# EAGLE schematic lun1k (EAGLE 6.2)
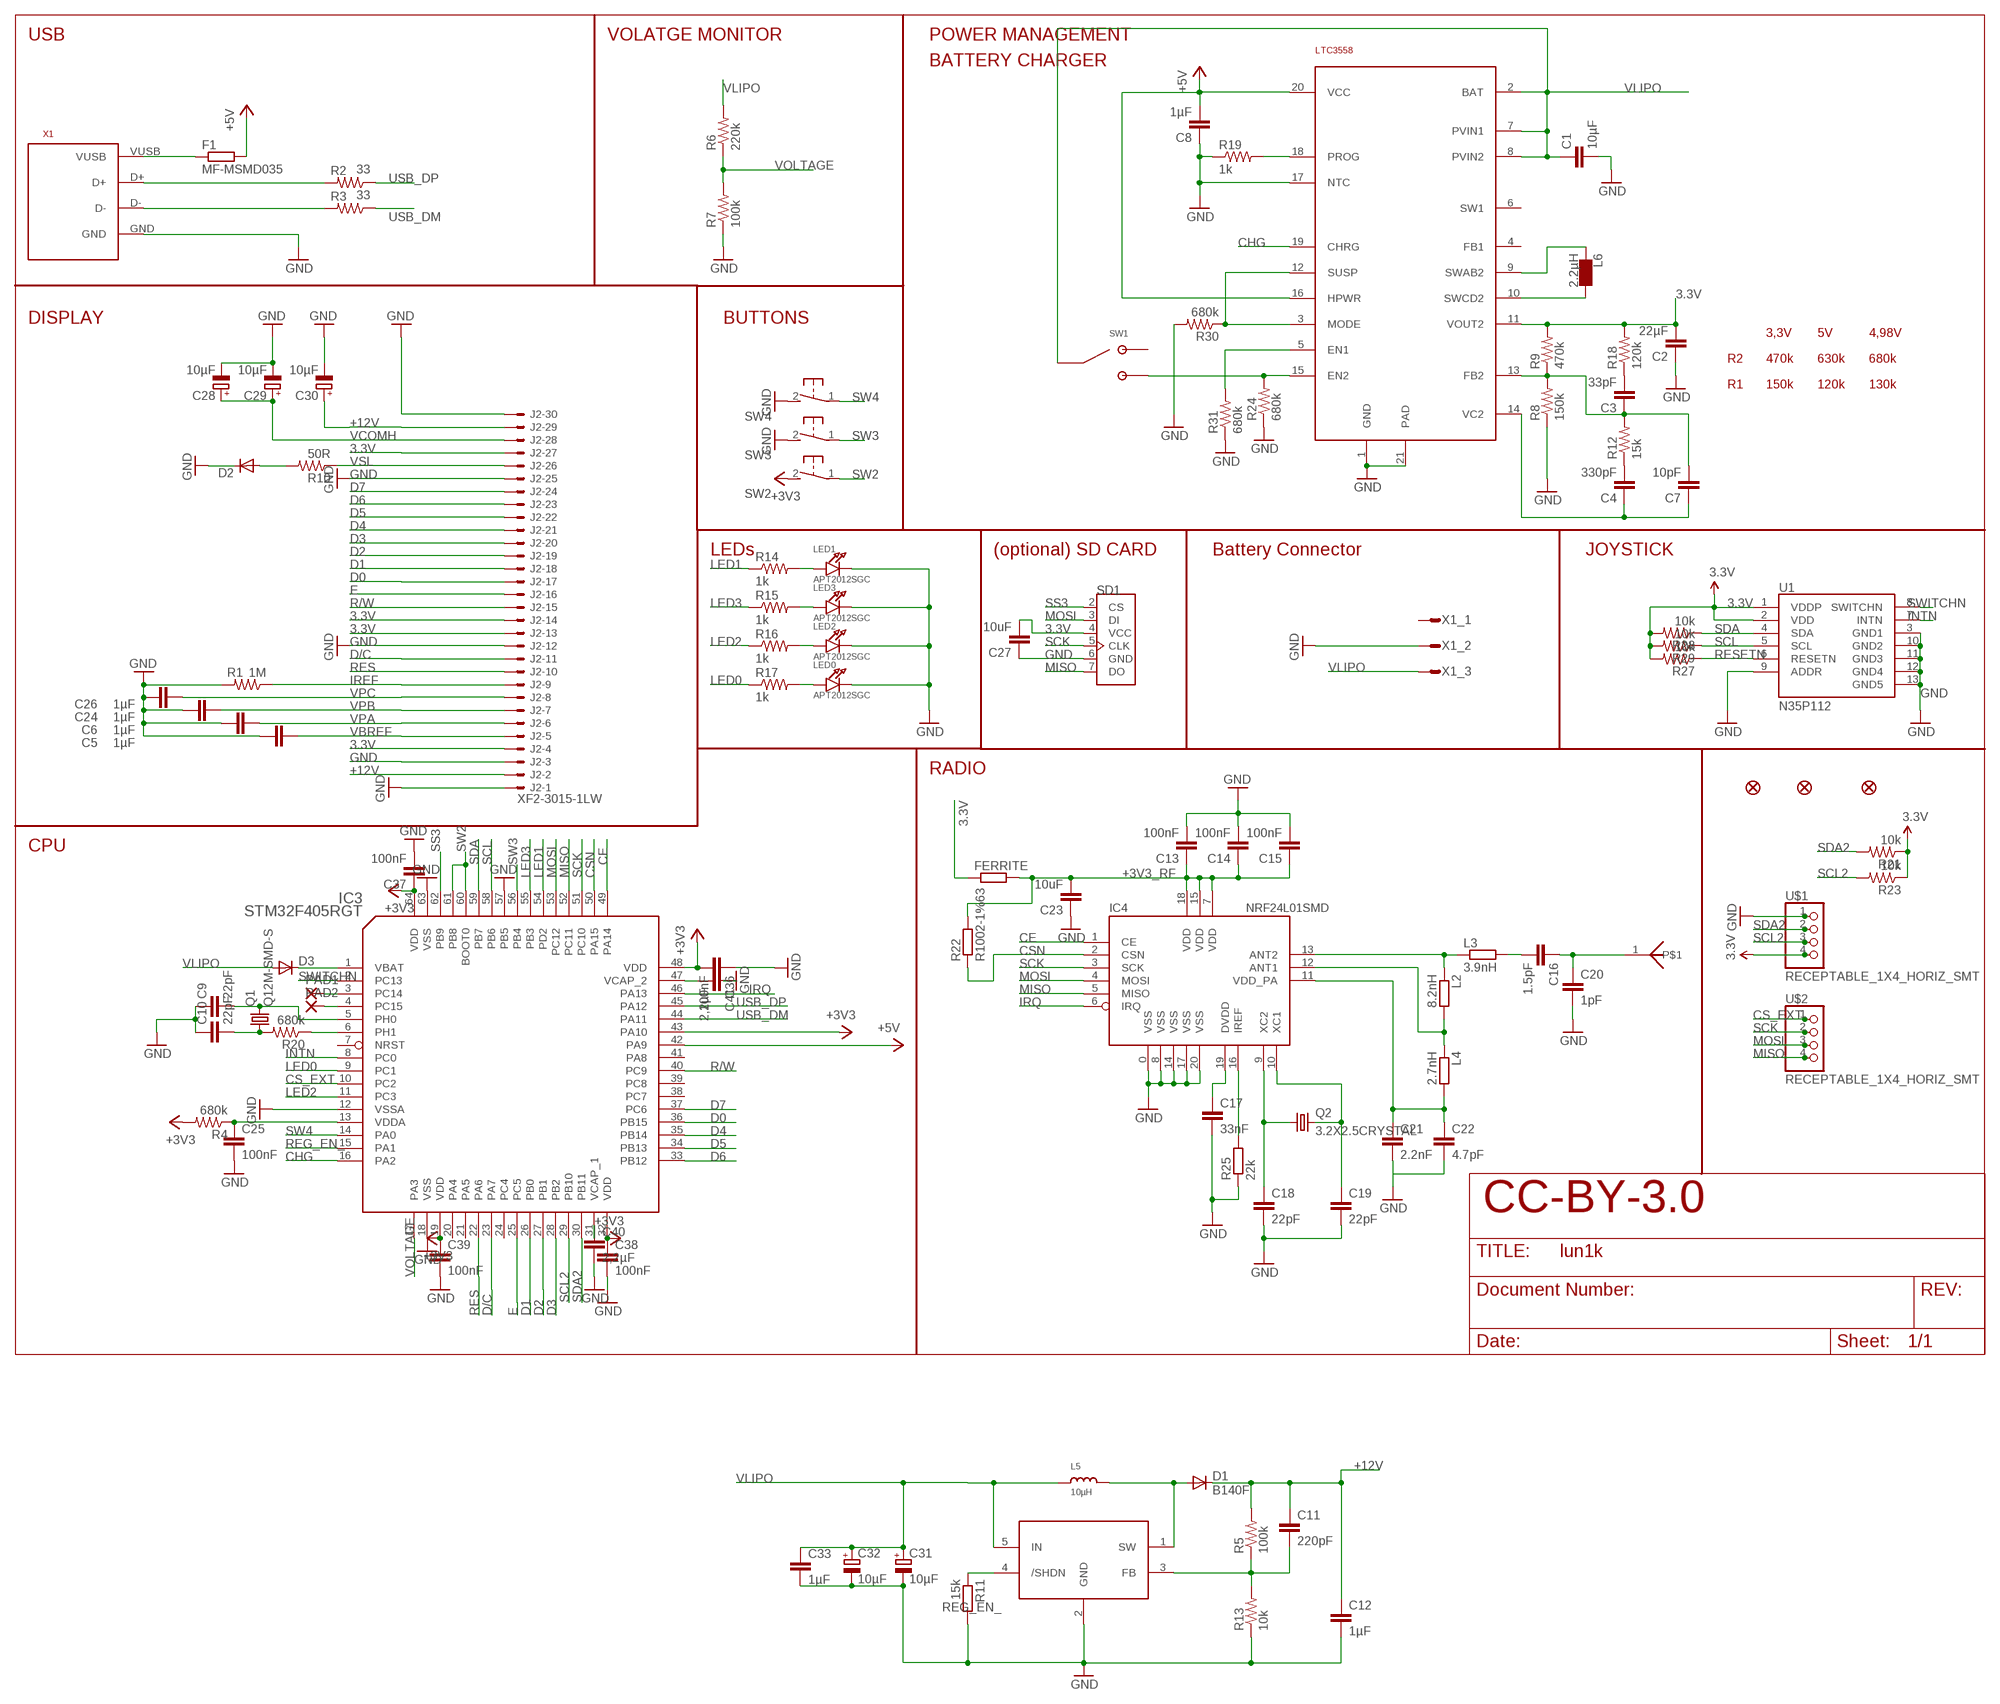
[diagram p0: schematic, sheet 1]

## Parts
ANT  CHIPANTENNA  [CHIPANTENNA]
C1  10µF  CAP0805  [0805]
C2  22µF  CAP0805  [0805]
C3  33pF  CAP0805  [0805]
C4  330pF  CAP0805  [0805]
C5  1µF  CAP0805  [0805]
C6  1µF  CAP0805  [0805]
C7  10pF  CAP0805  [0805]
C8  1µF  CAP0805  [0805]
C9  22pF  CAP0402-CAP  [0402-CAP]
C10  22pF  CAP0402-CAP  [0402-CAP]
C11  220pF  CAP0805  [0805]
C12  1µF  CAP0805  [0805]
C13  100nF  C-EUC0402K  [C0402K]
C14  100nF  C-EUC0402K  [C0402K]
C15  100nF  C-EUC0402K  [C0402K]
C16  1.5pF  C-EUC0402K  [C0402K]
C17  33nF  C-EUC0402K  [C0402K]
C18  22pF  C-EUC0402K  [C0402K]
C19  22pF  C-EUC0402K  [C0402K]
C20  1pF  C-EUC0402K  [C0402K]
C21  2.2nF  C-EUC0402K  [C0402K]
C22  4.7pF  C-EUC0402K  [C0402K]
C23  10uF  C-EUC0805K  [C0805K]
C24  1µF  CAP0805  [0805]
C25  100nF  CAP0402-CAP  [0402-CAP]
C26  1µF  CAP0805  [0805]
C27  10uF  C-EUC0805K  [C0805K]
C28  10µF  CPOL-EUSMCA  [SMC_A]
C29  10µF  CPOL-EUSMCA  [SMC_A]
C30  10µF  CPOL-EUSMCA  [SMC_A]
C31  10µF  CPOL-EUSMCA  [SMC_A]
C32  10µF  CPOL-EUSMCA  [SMC_A]
C33  1µF  CAP0805  [0805]
C36  100nF  CAP0402-CAP  [0402-CAP]
C37  100nF  CAP0402-CAP  [0402-CAP]
C38  100nF  CAP0402-CAP  [0402-CAP]
C39  100nF  CAP0402-CAP  [0402-CAP]
C40  2,2µF  CAP0805  [0805]
C41  2,2µF  CAP0805  [0805]
D1  B140F  DIODE-DO214AC  [DO214AC]
D2  DIODE-SOD323-R  [SOD323-R]
D3  DIODE-SOD323-R  [SOD323-R]
F1  MF-MSMD035  R-EU_R1210  [R1210]
FERRITE  R-EU_R0805  [R0805]
FID1  FIDUCIAL1.5X3  [FIDUCIAL-1.5X3]
FID2  FIDUCIAL1.5X3  [FIDUCIAL-1.5X3]
FID3  FIDUCIAL1.5X3  [FIDUCIAL-1.5X3]
IC1  LTC3558  [UD-QFN20]
IC2  LM27313  [SOT23-5L]
IC3  STM32F405RGT  [LQFP64]
IC4  NRF24L01SMD  [QFN20]
J2  XF2-3015-1LW  [XF2H-3015-1LW]
L2  8.2nH  R-EU_R0402  [R0402]
L3  3.9nH  R-EU_R0402  [R0402]
L4  2.7nH  R-EU_R0402  [R0402]
L5  10µH  INDUCTOR  [INDUCTOR_1007]
L6  2.2µH  CDH3D16  [CDRH3D16]
LED0  APT2012SGC  LED0805  [CHIPLED_0805]
LED1  APT2012SGC  LED0805  [CHIPLED_0805]
LED2  APT2012SGC  LED0805  [CHIPLED_0805]
LED3  APT2012SGC  LED0805  [CHIPLED_0805]
PAD1  SMD2  [SMD1,27-2,54]
PAD2  SMD2  [SMD1,27-2,54]
Q1  Q12M-SMD-S  X22-OSCILLATOR  [X22]
Q2  3.2X2.5CRYSTAL  [CRYSTAL3.2X2.5]
R1  1M  RESISTOR0805-RES  [0805]
R2  33  RESISTOR0402-RES  [0402-RES]
R3  33  RESISTOR0402-RES  [0402-RES]
R4  680k  RESISTOR0402-RES  [0402-RES]
R5  100k  RESISTOR0805-RES  [0805]
R6  220k  RESISTOR0402-RES  [0402-RES]
R7  100k  RESISTOR0402-RES  [0402-RES]
R8  150k  RESISTOR0805-RES  [0805]
R9  470k  RESISTOR0805-RES  [0805]
R10  50R  RESISTOR0805-RES  [0805]
R11  15k  R-EU_R0402  [R0402]
R12  15k  RESISTOR0805-RES  [0805]
R13  10k  RESISTOR0805-RES  [0805]
R14  1k  RESISTOR0402-RES  [0402-RES]
R15  1k  RESISTOR0402-RES  [0402-RES]
R16  1k  RESISTOR0402-RES  [0402-RES]
R17  1k  RESISTOR0402-RES  [0402-RES]
R18  120k  RESISTOR0805-RES  [0805]
R19  1k  RESISTOR0805-RES  [0805]
R20  680k  RESISTOR0402-RES  [0402-RES]
R21  10k  RESISTOR0402-RES  [0402-RES]
R22  R1002-1%63  R-EU_R0603  [R0603]
R23  10k  RESISTOR0402-RES  [0402-RES]
R24  680k  RESISTOR0402-RES  [0402-RES]
R25  22k  R-EU_R0603  [R0603]
R27  10k  RESISTOR0402-RES  [0402-RES]
R28  10k  RESISTOR0402-RES  [0402-RES]
R29  10k  RESISTOR0402-RES  [0402-RES]
R30  680k  RESISTOR0402-RES  [0402-RES]
R31  680k  RESISTOR0402-RES  [0402-RES]
SD1  MICROSD_SF-MICROSD  [MICROSD_MICROSD]
SW1  JS102011SAQN  [JS102011SAQN]
SW2  SWITCH_MCTAEF  [SWITCH_MCTAEF]
SW3  SWITCH_MCTAEF  [SWITCH_MCTAEF]
SW4  SWITCH_MCTAEF  [SWITCH_MCTAEF]
U1  N35P112  [N35P112]
U$1  RECEPTABLE_1X4_HORIZ_SMT  [RECEPTABLE_1X4_HORIZ_SMT]
U$2  RECEPTABLE_1X4_HORIZ_SMT  [RECEPTABLE_1X4_HORIZ_SMT]
X1  MICROUSB  [MICROAB]
X1_  JST-PH3  [JST-PH3]

## Nets
3.3V [GND/3V3]: C2.2 C27.2 C36.2 C37.1 C38.1 C39.1 FERRITE.1 IC1.11(VOUT2) IC3.19(VDD) IC3.32(VDD) IC3.43(PA10) IC3.48(VDD) IC3.64(VDD) J2.4 J2.13 J2.14 J2.27 R4.2 R9.2 R18.2 R21.1 R23.1 R27.2 R28.2 R29.2 SD1.4(VCC) SW2.2 U1.1(VDDP) U1.2(VDD) U$1.4 U$1.4@1 ; supply symbol labelled +3V3
+3V3_RF: C13.1 C14.1 C15.1 C23.2 FERRITE.2 IC4.7(VDD) IC4.15(VDD) IC4.18(VDD) R22.2
+5V [FAT]: C8.2 F1.2 IC1.16(HPWR) IC1.20(VCC) IC3.42(PA9)
+12V: C11.1 C12.1 C30.+ D1.C J2.2 J2.29 R5.2
CE: IC3.49(PA14) IC4.1(CE)
CHG: IC1.19(CHRG) IC3.16(PA2)
CS_EXT: IC3.10(PC2) U$2.1 U$2.1@1
CSN: IC3.50(PA15) IC4.2(CSN) R22.1
D0: IC3.36(PB15) J2.17
D1: IC3.26(PB0) J2.18
D2: IC3.27(PB1) J2.19
D3: IC3.28(PB2) J2.20
D4: IC3.35(PB14) J2.21
D5: IC3.34(PB13) J2.22
D6: IC3.33(PB12) J2.23
D7: IC3.37(PC6) J2.24
D+: R2.2 X1.D+
D-: R3.2 X1.D-
D/C: IC3.23(PA7) J2.11
E [GND/3V3]: IC3.25(PC5) J2.16
EN2: IC1.15(EN2) R24.2 SW1.3
GND [GND/3V3]: C1.2 C2.1 C5.1 C6.1 C8.1 C9.1 C10.1 C12.2 C13.2 C14.2 C15.2 C17.2 C18.2 C19.2 C20.2 C21.2 C22.2 C23.1 C24.1 C25.2 C26.1 C27.1 C28.- C29.- C30.- C31.- C32.- C33.2 C36.1 C37.2 C38.2 C39.2 C40.2 C41.1 D2.C IC1.1(GND) IC1.17(NTC) IC1.21(PAD) IC2.2(GND) IC3.12(VSSA) IC3.18(VSS) IC3.57(PB5) IC3.63(VSS) IC4.0(VSS) IC4.8(VSS) IC4.14(VSS) IC4.17(VSS) IC4.20(VSS) J2.1 J2.3 J2.12 J2.25 J2.30 LED0.C LED1.C LED2.C LED3.C R1.2 R7.1 R8.1 R11.2 R13.1 R19.1 R24.1 R25.1 R30.2 R31.1 SD1.6(GND) SW3.2 SW4.2 U1.3(GND1) U1.9(ADDR) U1.10(GND2) U1.11(GND3) U1.12(GND4) U1.13(GND5) U$1.1 U$1.1@1 X1.GND X1_.2
INTN: IC3.8(PC0) U1.7(INTN)
IREF: J2.9 R1.1
IRQ: IC3.46(PA13) IC4.6(IRQ)
LED0: IC3.9(PC1) R17.1
LED1: IC3.54(PD2) R14.1
LED2: IC3.11(PC3) R16.1
LED3: IC3.55(PB3) R15.1
MISO: IC3.52(PC11) IC4.5(MISO) SD1.7(DO) U$2.4 U$2.4@1
MOSI: IC3.53(PC12) IC4.4(MOSI) SD1.3(DI) U$2.3 U$2.3@1
N$1: C9.2 IC3.5(PH0) Q1.3
N$2: IC1.18(PROG) R19.2
N$3: C10.2 Q1.1 R20.2
N$4: LED0.A R17.2
N$5: LED2.A R16.2
N$6: LED3.A R15.2
N$7: C3.1 C7.2 IC1.13(FB2) R8.2 R9.1 R12.2
N$8: F1.1 X1.VUSB
N$9: LED1.A R14.2
N$10: C18.1 IC4.9(XC2) Q2.1
N$11: C19.1 IC4.10(XC1) Q2.3
N$12 [GND/3V3]: ANT.1 C16.1 C20.1
N$13: C3.2 R18.1
N$14: D2.A R10.2
N$15: C25.1 IC3.13(VDDA) R4.1
N$16: C4.2 R12.1
N$17: C4.1 C7.1 IC1.14(VC2)
N$18: IC1.10(SWCD2) L6.P$1
N$19: C40.1 IC3.31(VCAP_1)
N$20: C41.2 IC3.47(VCAP_2)
N$21: IC3.3(PC14) PAD1.1(P)
N$22: IC1.9(SWAB2) L6.P$2
N$23: IC3.4(PC15) PAD2.1(P)
N$24: D1.A IC2.1(SW) L5.P$2
N$25: IC1.3(MODE) IC1.12(SUSP) R30.1
N$26: C11.2 IC2.3(FB) R5.1 R13.2
N$27: IC1.5(EN1) R31.2
N$28: IC3.6(PH1) R20.1
N$29: D3.C IC3.1(VBAT)
N$70: C17.1 IC4.19(DVDD)
N$71: IC4.16(IREF) R25.2
N$73: C21.1 C22.1 IC4.11(VDD_PA) L4.2
N$78: IC4.12(ANT1) L2.2 L4.1
N$79: IC4.13(ANT2) L2.1 L3.1
N$80: C16.2 L3.2
R/W [GND/3V3]: IC3.40(PC9) J2.15
REG_EN_: IC2.4(/SHDN) IC3.15(PA1) R11.1
RES: IC3.22(PA6) J2.10
RESETN: R27.1 U1.6(RESETN)
SCK: IC3.51(PC10) IC4.3(SCK) SD1.5(CLK) U$2.2 U$2.2@1
SCL: IC3.58(PB6) R29.1 U1.5(SCL)
SCL2: IC3.29(PB10) R23.2 U$1.3 U$1.3@1
SDA: IC3.59(PB7) R28.1 U1.4(SDA)
SDA2: IC3.30(PB11) R21.2 U$1.2 U$1.2@1
SS3: IC3.62(PB9) SD1.2(CS)
SW2: IC3.60(BOOT0) IC3.61(PB8) SW2.1
SW3: IC3.56(PB4) SW3.1
SW4: IC3.14(PA0) SW4.1
SWITCHN: IC3.2(PC13) U1.8(SWITCHN)
USB_DM: IC3.44(PA11) R3.1
USB_DP: IC3.45(PA12) R2.1
VBREF: C5.2 J2.5
VCOMH: C28.+ C29.+ J2.28
VLIPO: C1.1 C31.+ C32.+ C33.1 D3.A IC1.2(BAT) IC1.7(PVIN1) IC1.8(PVIN2) IC2.5(IN) L5.P$1 R6.2 SW1.2 X1_.3
VOLTAGE: IC3.17(PA3) R6.1 R7.2
VPA: C6.2 J2.6
VPB: C24.2 J2.7
VPC: C26.2 J2.8
VSL: J2.26 R10.1
Unconnected: IC1.4(FB1) IC1.6(SW1) IC3.7(NRST) IC3.20(PA4) IC3.21(PA5) IC3.24(PC4) IC3.38(PC7) IC3.39(PC8) IC3.41(PA8) SW1.1 X1_.1

## Notes on the sheet
- USB | VOLATGE MONITOR | POWER MANAGEMENT
- BATTERY CHARGER
- DISPLAY | BUTTONS
- 3,3V | 5V | 4,98V
- R2 | 470k | 630k | 680k
- R1 | 150k | 120k | 130k
- LEDs | (optional) SD CARD | Battery Connector | JOYSTICK
- RADIO
- CPU
- CC-BY-3.0

## Library data of the parts
ANT = badge:CHIPANTENNA
C1-C8 C11 C12 C24 C26 C33 C40 C41 = SparkFun:CAP: Capacitor Standard 0603 ceramic capacitor, and 0.1" leaded capacitor.
C9 C10 C25 C36-C39 = SparkFun-Capacitors:CAP: Capacitor Standard 0603 ceramic capacitor, and 0.1" leaded capacitor.
C13-C23 C27 = rcl:C-EU: CAPACITOR, European symbol
C28-C32 = rcl:CPOL-EU: POLARIZED CAPACITOR, European symbol
D1-D3 = diode:DIODE-: DIODE
F1 FERRITE L2-L4 R11 R22 R25 = rcl:R-EU_: RESISTOR, European symbol
FID1-FID3 = SparkFun:FIDUCIAL: Fiducial Alignment Points Various fiducial points for machine vision alignment.
IC1 = seb:LTC3558
IC2 = seb:LM27313
IC3 = stm32:STM32F405R*T: STM32F405R*T ARM Cortex-M4 32b MCU+FPU, 210DMIPS, up to 1MB Flash/192+4KB RAM, USB OTG HS/FS, 17 TIMs, 3 ADCs, 15 comm.
IC4 = SparkFun:NRF24L01: 2.4GHz Low Power Transceiver This is the very popular, low cost, very low power RF transceiver from Nordic Semiconductor. Simple SPI interface. SKU: COM-00690
J2 = con-omron:XF2*-30?: OMRON FPC Connector Source : http://www.omron.com/ecb/products/pdf/fpc.pdf; OC_FARNELL: 1112560; OC_NEWARK: unknown
L5 = microbuilder:INDUCTOR: Inductors 0603: 10nH Ceramic Inductor - microwire antenna/RF (Digikey: 712-1434-2-ND) 0805: 560nH Ceramic Inductor - RF (Digikey: 553-1047-1-ND) 270nH Ceramic Inductor - Q = 40@250MHz, +-5%, 1 Ohm DC Resistance (Digikey: 535-10506-2-ND) 1007 (2518 Metric) SMT: 10µH 10% 250mOhm 820mA 1007 Inductor (Digikey: 587-2189-1-ND) 22µH 10% 500mOhm 580mA 1007 Inductor (Digikey: 587-2190-1-ND) 47µH 10% 950mOhm 420mA 1007 Inductor (Digikey: 587-2191-1-ND) 47µH 5% 100mOhm 1A 1008 Inductor (Digikey: 732-1816-1-ND) 5.0x5.0mm (Taiyo Yuden NR5040 Series) 6.8µH 20% 2.3A 64mOhm Inductor (Digikey: 587-2374-2-ND) 5.0x5.0mm (TDK VLC5045 Series) 4.7µH 20% 3.3A 34mOhm Inductor (Digikey: 445-6526-1-ND) 6.8µH 20% 2.7A 46mOhm Inductor (Digikey: 445-6527-1-ND) 6.0x6.0mm (TDK VLC6045 Series) 4.7µH 20% 3.8A 27mOhm Inductor (Digikey: 445-6538-2-ND) 6.8µH 20% 3A 41mOhm Inductor (Digikey: 445-6540-1-ND) 6.2µH 30% 2.2A 45mOhm Inductor (Digikey: SRR5028-6R2YCT-ND) - Not TDK VLC6045 but footprint should match 6.0x6.0mm (TDK SLF6045 Series) 6.8uH 30% 2A 33mOhm Inductor (Digikey: 445-4572-1-ND, Mouser: 810-SLF645T6R8N2R0PF)
L6 = seb:CDH3D16
LED0 LED1-LED3 = microbuilder:LED: LED 0603 - 0603 Surface Mount Package 2mA: Green LED - Low Power (3.9mcd, 2ma, 1.7Vf) - Digikey: 475-2709-2-ND Orange LED - Low Power (9.8mcd, 2ma, 1.8Vf) - Digikey: 475-1194-2-ND Red LED - Low Power (5mcd, 2ma, 1.8Vf) - Digikey: 475-1195-2-ND Yellow LED - Low Power (7mcd, 2ma, 1.8Vf) - Digikey: 475-1196-2-ND 5mA: Blue LED - Low Power (17mcd, 5ma, 2.9Vf) - Digikey: LNJ937W8CRACT-ND 0805 - 0805 Surface Mount Package 2mA: Red LED (8.8mcd, 2mA, 1.8Vf, Clear) - Low Power [Digikey: 475-2510-1-ND] Green LED (5mcd, 2mA, 1.8Vf, Clear) - Low Power [Digikey: 475-2730-1-ND] Yellow LED (11.3mcd, 2mA, 1.8Vf, Clear) - Low Power [Digikey: 475-2555-1-ND] 20mA: Red LED (104mcd, 20mA, Diffused) - LS R976 [Digikey: 475-1278-6-ND] Red LED (12mcd, 20mA, 2.0Vf, Clear) - APT2012EC [Digikey: 754-1128-1-ND] Green LED (15mcd, 20mA, 2.2Vf, Clear) - APT2012GC [Digikey: 754-1131-1-ND] Orange LED (160mcd, 20mA, 2.1Vf, Clear) - APT2012SECK [Digikey: 754-1130-1-ND] 1206 - 1206 Surface Mount Package Green LED (26mcd, 20mA, Diffused) - LG N971 [Digikey: 475-1407-6-ND] Red LED (15mcd, 20mA, Diffused) - LH N974 [Digikey: 475-1416-6-ND]
PAD1 PAD2 = wirepad:SMD2: SMD PAD
Q1 = seb:X22-OSCILLATOR
Q2 = badge:3.2X2.5CRYSTAL
R1 R5 R10 R13 R21 R23 R27-R29 = SparkFun:RESISTOR: Resistor Basic schematic elements and footprints for 0603, 1206, and PTH resistors.
R2 R3 R6 R7 R14-R17 = SparkFun-Passives:RESISTOR: Resistor Basic schematic elements and footprints for 0603, 1206, and PTH resistors.
R4 R8 R9 R12 R18-R20 R24 R30 R31 = SparkFun-Resistors:RESISTOR: Resistor Basic schematic elements and footprints for 0603, 1206, and PTH resistors.
SD1 = sd:MICROSD_SF-MICROSD
SW1 = badge:JS102011SAQN
SW2-SW4 = seb:SWITCH_MCTAEF
U1 = miscellany:N35P112
U$1 U$2 = seb:RECEPTABLE_1X4_HORIZ_SMT
X1 = badge:MICROUSB
X1_ = badge:JST-PH3

## Net classes
1 FAT: width 0.2 mm, drill 0.4 mm
2 GND/3V3: width 0.2 mm, drill 0.4 mm